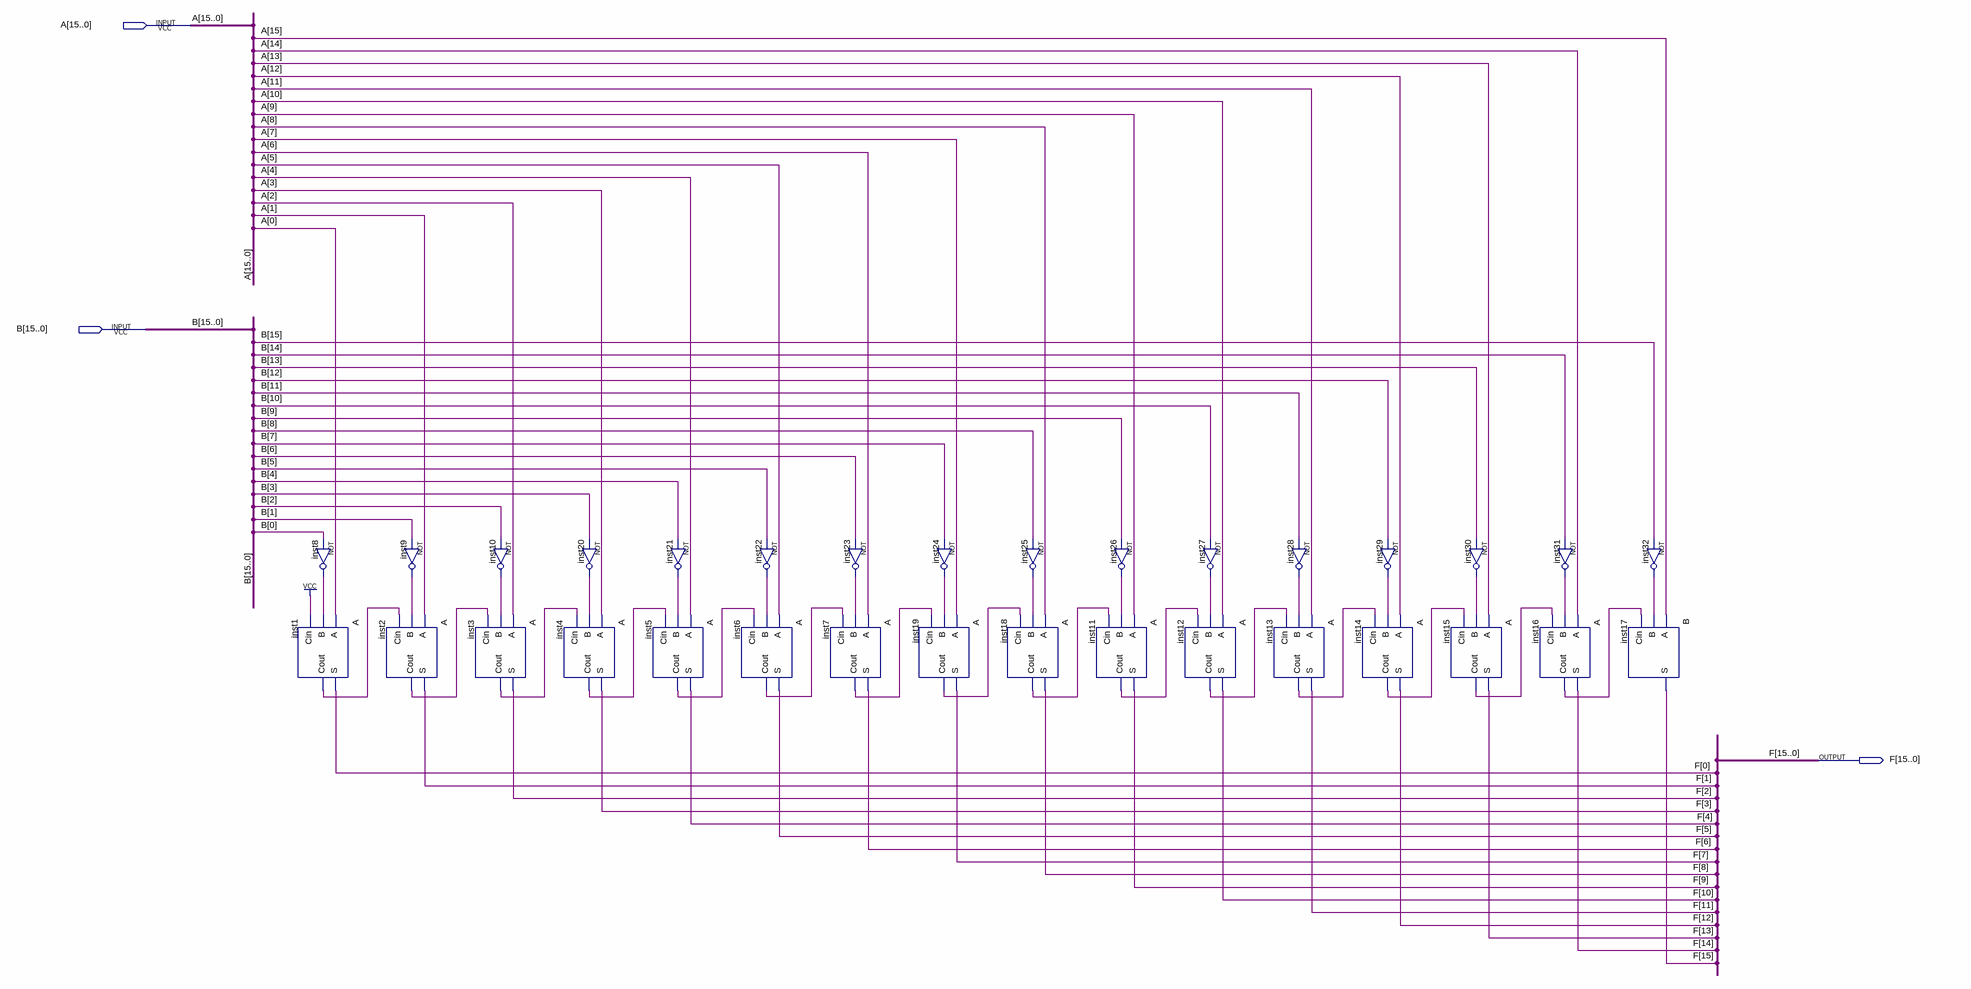
[diagram p0: schematic sheet]
// Quartus schematic AtruB.bdf as structural Verilog: 32 symbols, 3 pins
module AtruB (
  input  [15:0] A,
  input  [15:0] B,
  output [15:0] F
);

  wire inst1_cout, inst2_cout, inst3_cout, inst4_cout, inst5_cout, inst6_cout, inst7_cout, inst8_out,
       inst9_out, inst10_out, inst11_cout, inst12_cout, inst13_cout, inst14_cout, inst15_cout, inst16_cout,
       inst18_cout, inst19_cout, inst20_out, inst21_out, inst22_out, inst23_out, inst24_out, inst25_out,
       inst26_out, inst27_out, inst28_out, inst29_out, inst30_out, inst31_out, inst32_out;

  not inst8 (inst8_out, B[0]);
  A inst1 (.A(A[0]), .B(inst8_out), .Cin(1'b1), .S(F[0]), .Cout(inst1_cout));
  not inst9 (inst9_out, B[1]);
  A inst2 (.A(A[1]), .B(inst9_out), .Cin(inst1_cout), .S(F[1]), .Cout(inst2_cout));
  A inst3 (.A(A[2]), .B(inst10_out), .Cin(inst2_cout), .S(F[2]), .Cout(inst3_cout));
  not inst10 (inst10_out, B[2]);
  A inst4 (.A(A[3]), .B(inst20_out), .Cin(inst3_cout), .S(F[3]), .Cout(inst4_cout));
  not inst20 (inst20_out, B[3]);
  not inst21 (inst21_out, B[4]);
  A inst5 (.A(A[4]), .B(inst21_out), .Cin(inst4_cout), .S(F[4]), .Cout(inst5_cout));
  not inst22 (inst22_out, B[5]);
  A inst6 (.A(A[5]), .B(inst22_out), .Cin(inst5_cout), .S(F[5]), .Cout(inst6_cout));
  A inst7 (.A(A[6]), .B(inst23_out), .Cin(inst6_cout), .S(F[6]), .Cout(inst7_cout));
  not inst23 (inst23_out, B[6]);
  A inst19 (.A(A[7]), .B(inst24_out), .Cin(inst7_cout), .S(F[7]), .Cout(inst19_cout));
  not inst24 (inst24_out, B[7]);
  not inst25 (inst25_out, B[8]);
  A inst18 (.A(A[8]), .B(inst25_out), .Cin(inst19_cout), .S(F[8]), .Cout(inst18_cout));
  not inst26 (inst26_out, B[9]);
  A inst11 (.A(A[9]), .B(inst26_out), .Cin(inst18_cout), .S(F[9]), .Cout(inst11_cout));
  A inst12 (.A(A[10]), .B(inst27_out), .Cin(inst11_cout), .S(F[10]), .Cout(inst12_cout));
  not inst27 (inst27_out, B[10]);
  A inst13 (.A(A[11]), .B(inst28_out), .Cin(inst12_cout), .S(F[11]), .Cout(inst13_cout));
  not inst28 (inst28_out, B[11]);
  not inst29 (inst29_out, B[12]);
  A inst14 (.A(A[12]), .B(inst29_out), .Cin(inst13_cout), .S(F[12]), .Cout(inst14_cout));
  not inst30 (inst30_out, B[13]);
  A inst15 (.A(A[13]), .B(inst30_out), .Cin(inst14_cout), .S(F[13]), .Cout(inst15_cout));
  A inst16 (.A(A[14]), .B(inst31_out), .Cin(inst15_cout), .S(F[14]), .Cout(inst16_cout));
  not inst31 (inst31_out, B[14]);
  B inst17 (.A(A[15]), .B(inst32_out), .Cin(inst16_cout), .S(F[15]));
  not inst32 (inst32_out, B[15]);
endmodule
